# EAGLE schematic MPPT (EAGLE 9.0.1)
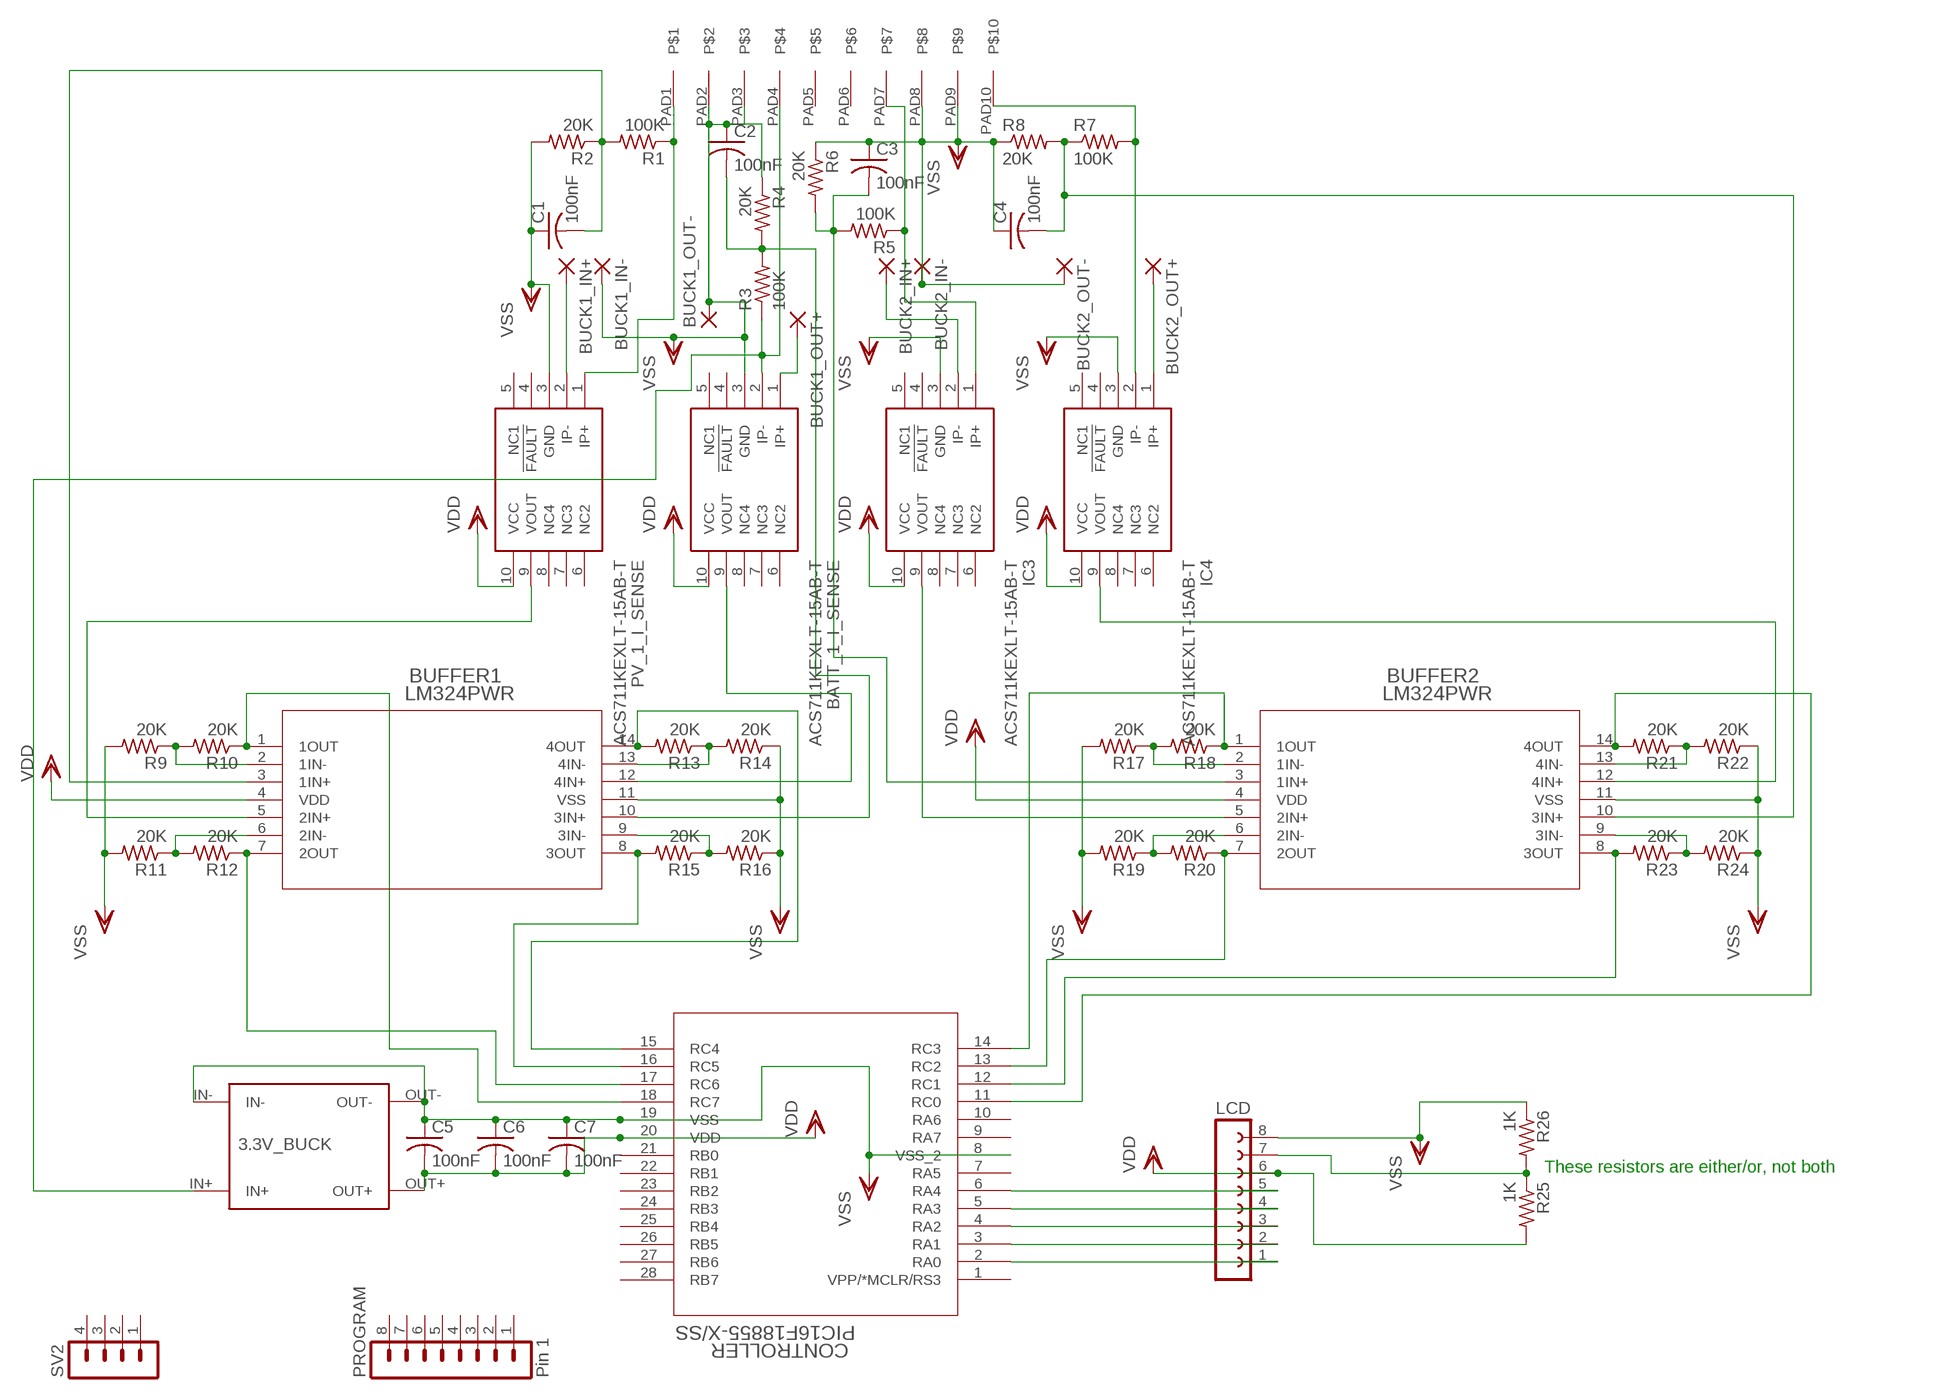
[diagram p0: schematic, sheet 1]

## Parts
3.3V_BUCK  TINY_BUCK  [TINY_BUCK]
BATT_1_I_SENSE  ACS711KEXLT-15AB-T  [EX-PACKAGE]
BUCK1_IN+  3,81/1,4  [3,81/1,4]
BUCK1_IN-  3,81/1,4  [3,81/1,4]
BUCK1_OUT+  3,81/1,4  [3,81/1,4]
BUCK1_OUT-  3,81/1,4  [3,81/1,4]
BUCK2_IN+  3,81/1,4  [3,81/1,4]
BUCK2_IN-  3,81/1,4  [3,81/1,4]
BUCK2_OUT+  3,81/1,4  [3,81/1,4]
BUCK2_OUT-  3,81/1,4  [3,81/1,4]
BUFFER1  LM324PWR  [PW14]
BUFFER2  LM324PWR  [PW14]
C1  100nF  C-USC0603  [C0603]
C2  100nF  C-USC0603  [C0603]
C3  100nF  C-USC0603  [C0603]
C4  100nF  C-USC0603  [C0603]
C5  100nF  C-USC0603  [C0603]
C6  100nF  C-USC0603  [C0603]
C7  100nF  C-USC0603  [C0603]
CONTROLLER  PIC16F18855-X/SS  [SSOP28_MC]
IC3  ACS711KEXLT-15AB-T  [EX-PACKAGE]
IC4  ACS711KEXLT-15AB-T  [EX-PACKAGE]
LCD  FE08-1  [FE08]
PROGRAM  Pin 1  MA08-1  [MA08-1]
PV_1_I_SENSE  ACS711KEXLT-15AB-T  [EX-PACKAGE]
R1  100K  R-US_R0603  [R0603]
R2  20K  R-US_R0603  [R0603]
R3  100K  R-US_R0603  [R0603]
R4  20K  R-US_R0603  [R0603]
R5  100K  R-US_R0603  [R0603]
R6  20K  R-US_R0603  [R0603]
R7  100K  R-US_R0603  [R0603]
R8  20K  R-US_R0603  [R0603]
R9  20K  R-US_R0603  [R0603]
R10  20K  R-US_R0603  [R0603]
R11  20K  R-US_R0603  [R0603]
R12  20K  R-US_R0603  [R0603]
R13  20K  R-US_R0603  [R0603]
R14  20K  R-US_R0603  [R0603]
R15  20K  R-US_R0603  [R0603]
R16  20K  R-US_R0603  [R0603]
R17  20K  R-US_R0603  [R0603]
R18  20K  R-US_R0603  [R0603]
R19  20K  R-US_R0603  [R0603]
R20  20K  R-US_R0603  [R0603]
R21  20K  R-US_R0603  [R0603]
R22  20K  R-US_R0603  [R0603]
R23  20K  R-US_R0603  [R0603]
R24  20K  R-US_R0603  [R0603]
R25  1K  R-US_R0603  [R0603]
R26  1K  R-US_R0603  [R0603]
SV2  MA04-1  [MA04-1]
U$1  CONN-KF2EDG-10(5.08)E-BAYPLUGGABLECONNECTORS  [CONN-KF2EDG-10(5.08)]

## Nets
N$1: PV_1_I_SENSE.1(IP+) R1.1 U$1.PAD1
N$2: BUFFER1.5(2IN+) PV_1_I_SENSE.9(VOUT)
N$3: BUFFER1.3(1IN+) C1.2 R1.2 R2.1
N$4: BATT_1_I_SENSE.1(IP+) BUCK1_OUT+.1(P)
N$5: BUFFER1.10(3IN+) C2.2 R3.2 R4.2
N$6: 3.3V_BUCK.IN+ BATT_1_I_SENSE.2(IP-) R3.1 U$1.PAD4
N$7: BUCK2_OUT+.1(P) IC4.1(IP+)
N$8: IC3.1(IP+) R5.1 U$1.PAD7
N$9: BUCK2_IN+.1(P) IC3.2(IP-)
N$10: BUFFER2.3(1IN+) C3.2 R5.2 R6.2
N$11: IC4.2(IP-) R7.2 U$1.PAD10
N$12: BUFFER2.10(3IN+) C4.2 R7.1 R8.2
N$13: BUCK1_IN+.1(P) PV_1_I_SENSE.2(IP-)
N$14: BUFFER1.9(3IN-) R15.1 R16.2
N$15: BUFFER1.1(1OUT) CONTROLLER.18(RC7) R10.1
N$16: BUFFER1.6(2IN-) R11.1 R12.2
N$17: BUFFER1.7(2OUT) CONTROLLER.17(RC6) R12.1
N$18: BUFFER1.13(4IN-) R13.1 R14.2
N$19: BUFFER1.2(1IN-) R9.1 R10.2
N$20: BUFFER1.14(4OUT) CONTROLLER.15(RC4) R13.2
N$21: BUFFER1.8(3OUT) CONTROLLER.16(RC5) R15.2
N$22: BATT_1_I_SENSE.9(VOUT) BUFFER1.12(4IN+)
N$23: CONTROLLER.2(RA0) LCD.1
N$24: BUFFER2.1(1OUT) CONTROLLER.14(RC3) R18.1
N$25: BUFFER2.7(2OUT) CONTROLLER.13(RC2) R20.1
N$26: BUFFER2.6(2IN-) R19.1 R20.2
N$27: BUFFER2.14(4OUT) CONTROLLER.11(RC0) R21.2
N$28: BUFFER2.13(4IN-) R21.1 R22.2
N$29: BUFFER2.8(3OUT) CONTROLLER.12(RC1) R23.2
N$30: BUFFER2.9(3IN-) R23.1 R24.2
N$31: BUFFER2.2(1IN-) R17.1 R18.2
N$32: BUFFER2.5(2IN+) IC3.9(VOUT)
N$33: BUFFER2.12(4IN+) IC4.9(VOUT)
N$34: CONTROLLER.3(RA1) LCD.2
N$35: CONTROLLER.4(RA2) LCD.3
N$36: CONTROLLER.5(RA3) LCD.4
N$37: CONTROLLER.6(RA4) LCD.5
N$38: LCD.7 R25.1 R26.2
VDD: 3.3V_BUCK.OUT+ BATT_1_I_SENSE.10(VCC) BUFFER1.4(VDD) BUFFER2.4(VDD) C5.2 C6.2 C7.2 CONTROLLER.20(VDD) IC3.10(VCC) IC4.10(VCC) LCD.6 PV_1_I_SENSE.10(VCC) R25.2
VSS: 3.3V_BUCK.IN- 3.3V_BUCK.OUT- BATT_1_I_SENSE.3(GND) BUCK1_IN-.1(P) BUCK1_OUT-.1(P) BUCK2_IN-.1(P) BUCK2_OUT-.1(P) BUFFER1.11(VSS) BUFFER2.11(VSS) C1.1 C2.1 C3.1 C4.1 C5.1 C6.1 C7.1 CONTROLLER.8(VSS_2) CONTROLLER.19(VSS) IC3.3(GND) IC4.3(GND) LCD.8 PV_1_I_SENSE.3(GND) R2.2 R4.1 R6.1 R8.1 R9.2 R11.2 R14.1 R16.1 R17.2 R19.2 R22.1 R24.1 R26.1 U$1.PAD2 U$1.PAD3 U$1.PAD8 U$1.PAD9
Unconnected: BATT_1_I_SENSE.4(!FAULT) BATT_1_I_SENSE.5(NC1) BATT_1_I_SENSE.6(NC2) BATT_1_I_SENSE.7(NC3) BATT_1_I_SENSE.8(NC4) CONTROLLER.1(VPP/*MCLR/RS3) CONTROLLER.7(RA5) CONTROLLER.9(RA7) CONTROLLER.10(RA6) CONTROLLER.21(RB0) CONTROLLER.22(RB1) CONTROLLER.23(RB2) CONTROLLER.24(RB3) CONTROLLER.25(RB4) CONTROLLER.26(RB5) CONTROLLER.27(RB6) CONTROLLER.28(RB7) IC3.4(!FAULT) IC3.5(NC1) IC3.6(NC2) IC3.7(NC3) IC3.8(NC4) IC4.4(!FAULT) IC4.5(NC1) IC4.6(NC2) IC4.7(NC3) IC4.8(NC4) PROGRAM.1 PROGRAM.2 PROGRAM.3 PROGRAM.4 PROGRAM.5 PROGRAM.6 PROGRAM.7 PROGRAM.8 PV_1_I_SENSE.4(!FAULT) PV_1_I_SENSE.5(NC1) PV_1_I_SENSE.6(NC2) PV_1_I_SENSE.7(NC3) PV_1_I_SENSE.8(NC4) SV2.1 SV2.2 SV2.3 SV2.4 U$1.PAD5 U$1.PAD6

## Notes on the sheet
- These resistors are either/or, not both

## Library data of the parts
3.3V_BUCK = Tiny_Buck:TINY_BUCK: E_Bay 3 Amp Buck Converter
BATT_1_I_SENSE IC3 IC4 PV_1_I_SENSE = SamacSys_Parts:ACS711KEXLT-15AB-T: Hall Effect Linear Current Sensor with Overcurrent Fault Output for <100 V Isolation Applications Source: Datasheet <https://www.arrow.com/en/products/acs711kexlt-15ab-t/allegro-microsystems>; ARROW_PART_NUMBER: ACS711KEXLT-15AB-T; DESCRIPTION: Hall Effect Linear Current Sensor with Overcurrent Fault Output for <100 V Isolation Applications; HEIGHT: mm; MANUFACTURER_NAME: Allegro Microsystems; MANUFACTURER_PART_NUMBER: ACS711KEXLT-15AB-T
BUCK1_IN+ BUCK1_IN- BUCK1_OUT+ BUCK1_OUT- BUCK2_IN+ BUCK2_IN- BUCK2_OUT+ BUCK2_OUT- = wirepad:3,81/1,4: THROUGH-HOLE PAD
BUFFER1 BUFFER2 = LM324PWR:LM324PWR; MANUFACTURER_PART_NUMBER: LM324PWR; VENDOR: Vendor
C1-C7 = resistor:C-US: CAPACITOR, American symbol
CONTROLLER = 16F18855_SSOP:PIC16F18855-X/SS; COPYRIGHT: Copyright (C) 2016 Accelerated Designs. All rights reserved; MANUFACTURER_PART_NUMBER: pic16f18855-x/ss; VENDOR: Microchip
LCD = con-lsta:FE08-1: FEMALE HEADER; OC_FARNELL: unknown; OC_NEWARK: unknown
PROGRAM = con-lstb:MA08-1: PIN HEADER; OC_FARNELL: unknown; OC_NEWARK: unknown
R1-R26 = resistor:R-US_: RESISTOR, American symbol
SV2 = con-lstb:MA04-1: PIN HEADER; OC_FARNELL: unknown; OC_NEWARK: unknown
U$1 = Stuff_I_Use:CONN-KF2EDG-10(5.08)